# Altium schematic sheet USB Downstream.SchDoc
size 297 x 209 mm; CompanyName: Sainsbury Wellcome Centre; Organization: FabLab; Address1: Sainsbury Wellcome Centre; Address2: 25 Howland Street; Address3: London; Address4: W1T 4JG; DocumentNumber: 11; SheetNumber: 11; SheetTotal: 14; swcgroup: FabLab; Org: Sainsbury Wellcome Centre; Add1: 25 Howland Street; Add2: London; Add3: W1T 4JG; WebAddress: www.sainsburywellcome.org; SheetSize: A4; SheetName: USB Downstream
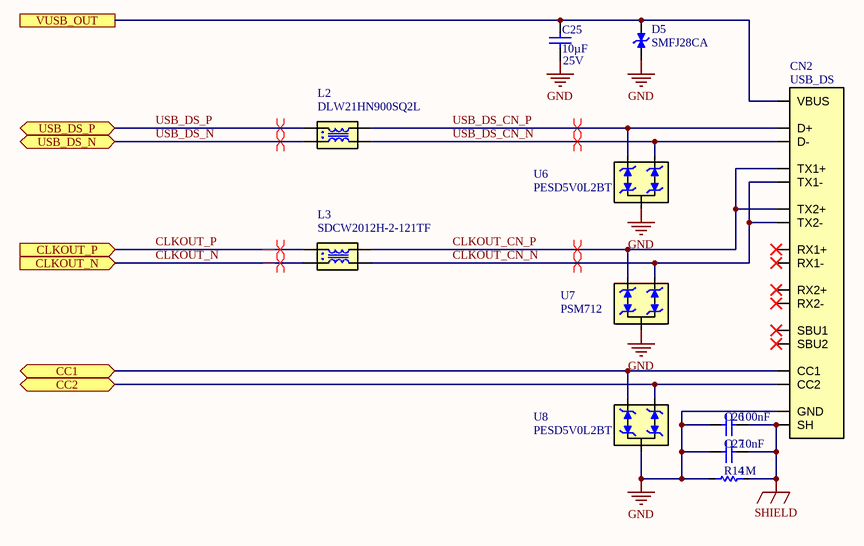
[diagram p0: USB Downstream.SchDoc]

## Parts
C25  value 10µF  Voltage Rating: 25V  [CAP_CHIP_0603]  (hidden comment: C0603-10uF-25V)
C26  value 100nF  [CAP_CHIP_0603]  (hidden comment: C0603-100nF-50V)
C27  value 10nF  [CAP_CHIP_0603]  (hidden comment: C0603-10nF-50V)
CN2  USB_DS  [TYPEC-24P]
D5  SMFJ28CA  [SOD123]
L2  PartNumber: DLW21HN900SQ2L  [IND_CHOKE_0805]  (hidden comment: CHOKE-90R)
L3  PartNumber: SDCW2012H-2-121TF  [IND_CHOKE_0805]  (hidden comment: CHOKE-120R)
R14  value 1M  [RES_CHIP_0603]  (hidden comment: R0603-1M)
U6  PESD5V0L2BT  [SOT23]
U7  PSM712  [SOT23]
U8  PESD5V0L2BT  [SOT23]

## Ports
CC1 (bidir), CC2 (bidir), CLKOUT_N (in), CLKOUT_P (in), USB_DS_N (bidir), USB_DS_P (bidir), VUSB_OUT

## Nets
GND: C25.1 C26.2 C27.2 CN2.A1,_A12,_B1,_B12(GND) D5.1(K) R14.2 U6.3(COM) U7.3(COM) U8.3(COM)
SHIELD: C26.1 C27.1 CN2.0(SH) R14.1
CC1: CN2.A5(CC1) U8.1(ANODE) ; port CC1
CC2: CN2.B5(CC2) U8.2(ANODE) ; port CC2
CLKOUT_CN_N: CN2.A3(TX1-) CN2.B3(TX2-) L3.3 U7.1(ANODE)
CLKOUT_CN_P: CN2.A2(TX1+) CN2.B2(TX2+) L3.2 U7.2(ANODE)
CLKOUT_N: L3.4 ; port CLKOUT_N
CLKOUT_P: L3.1 ; port CLKOUT_P
USB_DS_CN_N: CN2.A7,_B7(D-) L2.3 U6.1(ANODE)
USB_DS_CN_P: CN2.A6,_B6(D+) L2.2 U6.2(ANODE)
USB_DS_N: L2.4 ; port USB_DS_N
USB_DS_P: L2.1 ; port USB_DS_P
VUSB_OUT: C25.2 CN2.A4,_A9,_B4,_B9(VBUS) D5.2(A) ; port VUSB_OUT

Not connected (* = marked no-connect by the designer): CN2 A8(SBU1)* A10(RX2-)* A11(RX2+)* B8(SBU2)* B10(RX1-)* B11(RX1+)*

## Layout directives
differential pair; differential pair class USB: USB_DS_CN_N, USB_DS_CN_P, USB_DS_N, USB_DS_P
differential pair; differential pair class RS485: CLKOUT_CN_N, CLKOUT_CN_P, CLKOUT_N, CLKOUT_P

## Notes on the sheet
- FILE
- VARIANT
- DATE
- REVISION
- SHEET
- /
- PROJECT
- SIZE

## Library data of the parts
C25 = CMP-611-0050-6: 0603 Multilayer Ceramic Capacitors MLCC; PartNumber: CL10A106MA8NRNC; Dielectric: X5R; Pick&PlaceFootprint: C0603; Tolerance: 20%; Case/Package: 0603; LCSC Part N.: C96446; RoHS: Yes; Capacitor Type: Ceramic; Mount: SMD
C26 = CMP-611-0027-24: 0603 Multilayer Ceramic Capacitors MLCC; PartNumber: CC0603KRX7R9BB104; Voltage Rating: 50V; Pick&PlaceFootprint: C0603; Dielectric: X7R; Tolerance: 10%; LCSC Part N.: C14663; Capacitor Type: Ceramic; Case/Package: 0603; RoHS: Yes; Mount: SMD
C27 = CMP-611-0022-7: 0603 Multilayer Ceramic Capacitors MLCC; PartNumber: 0603B103K500NT; Tolerance: 10%; Voltage Rating: 50V; Dielectric: X7R; Pick&PlaceFootprint: C0603; Capacitor Type: Ceramic; Mount: SMD; Case/Package: 0603; LCSC Part N.: C57112; RoHS: Yes
CN2 = CMP-340-0003-10: USB 3.1 5A 1 260℃ Surface Mount，Right Angle 24P Female -45℃~+85℃ Type-C SMD USB Connectors; pin to pad: S1>G1+G2+G3+G4+G5+G6; PartNumber: TYPEC-324G-BCP24; Current Rating: 5A; Mount: Surface Mount; LCSC Part N.: C920230; Orientation: Horizontal; Gender: Female
D5 = CMP-210-0002-1: 4.4A 45.4V@4.4A 200W 31.1V Bi-Directional 28V SOD-123F Electrostatic and Surge Protection (TVS/ESD); Breakdown Voltage: 31V; Clamp Voltage: 45.4V; PartNumber: SMFJ28CA; Stand-off Voltage: 28V; Pick&PlaceFootprint: SOD-123; Mount: Surface Mount; LCSC Part N.: C5125651
L2 = CMP-600-0002-3: Data Line Filter, 2 Function(s), 50V, 0.33A, 4 Pin(s); DC Resistance-Max: 350mR; Insulation Resistance-Min: 10MR; Current Rating: 330mA; Output Impedance: 90R; Channels: 2; LCSC Part N.: C80529; Voltage Rating: 50V
L3 = CMP-600-0007-1: Data Line Filter, 2 Function(s), 20V, 0.28A, 4 Pin(s); Output Impedance: 120R; Current Rating: 280mA; DC Resistance-Max: 400mR; Insulation Resistance-Min: 10kR; Channels: 2; LCSC Part N.: C370248; Voltage Rating: 20V
R14 = CMP-633-0066-20: 100mW Thick Film Resistors 75V ±100ppm/℃ ±1% 0603 Chip Resistor; PartNumber: 0603WAF1004T5E; Pick&PlaceFootprint: R0603; Number of Resistors: 1; Mount: Surface Mount; Case/Package: 0603; Voltage Rating: 75V; LCSC Part N.: C22935; Power Rating: 100mW; Tolerance: 1%
U6 U8 = CMP-210-0005-2: Low capacitance double bidirectional ESD protection diodes in SOT23; Pick&PlaceFootprint: SOT-23; Stand-off Voltage: 5V; Breakdown Voltage: 7.5V; Clamp Voltage: 10V; PartNumber: PESD5V0L2BT; LCSC Part N.: C2858724
U7 = CMP-210-0000-4: 19V 13.3V 12V SOT-23 Electrostatic and Surge Protection (TVS/ESD); PartNumber: PSM712-LF-T7; LCSC Part N.: C32677; Stand-off Voltage: 12V; Pick&PlaceFootprint: SOT-23; Breakdown Voltage: 13.3V; Clamp Voltage: 19V; Mount: Surface Mount